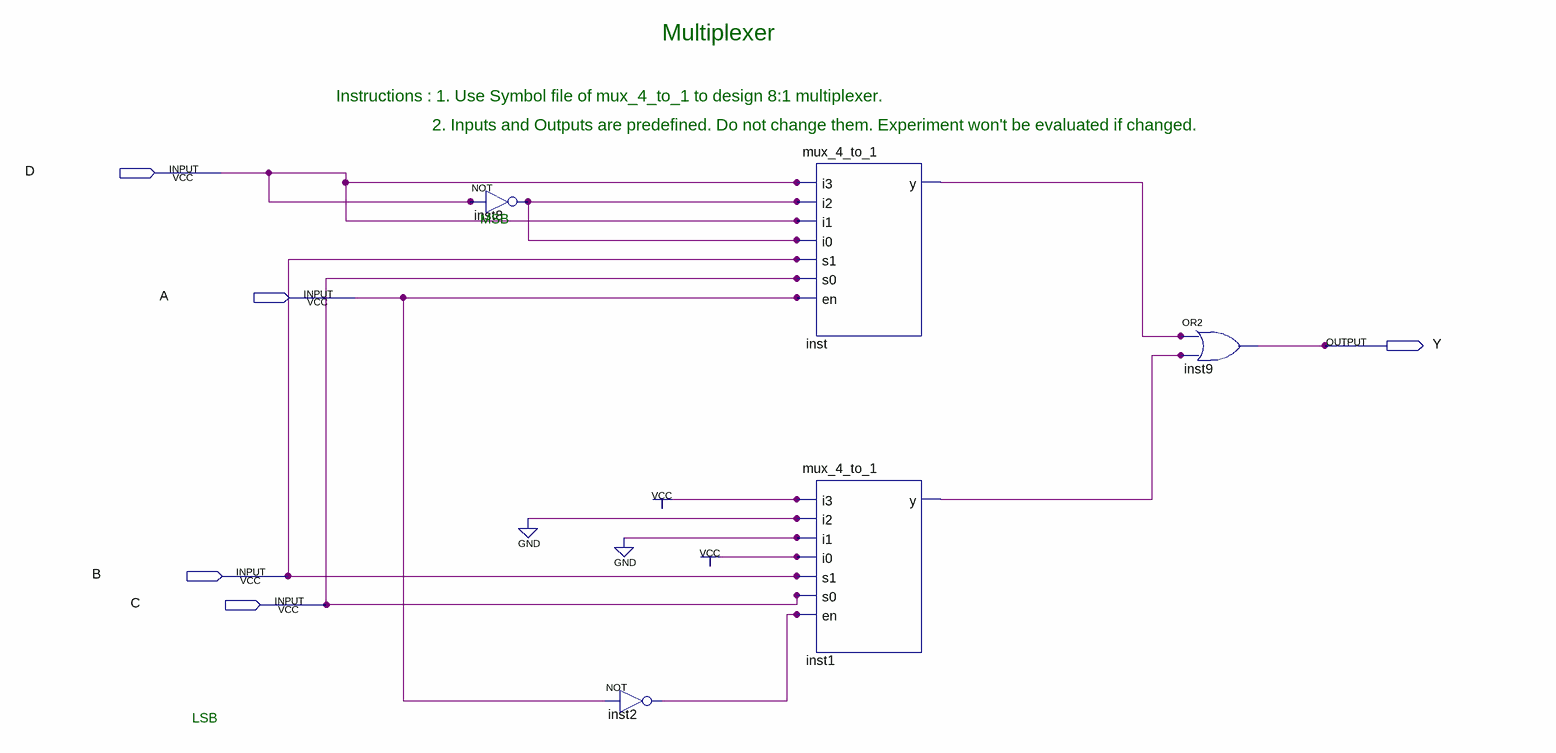
[diagram p0: schematic sheet]
// Quartus schematic mux_8_to_1.bdf as structural Verilog: 5 symbols, 5 pins
module mux_8_to_1 (
  input  D,
  input  A,
  input  B,
  input  C,
  output Y
);

  wire inst1_y, inst2_out, inst8_out, inst_y;

  not inst8 (inst8_out, D);
  not inst2 (inst2_out, A);
  mux_4_to_1 inst (.i3(D), .i2(inst8_out), .i1(D), .i0(inst8_out), .s1(B), .s0(C), .en(A), .y(inst_y));
  mux_4_to_1 inst1 (.i3(1'b1), .i2(1'b0), .i1(1'b0), .i0(1'b1), .s1(B), .s0(C), .en(inst2_out), .y(inst1_y));
  or inst9 (Y, inst_y, inst1_y);

  // Notes on the sheet:
  //   Multiplexer
  //   Instructions : 1. Use Symbol file of mux_4_to_1 to design 8:1 multiplexer. 
  //   2. Inputs and Outputs are predefined. Do not change them. Experiment won't be evaluated if changed.
  //   MSB
  //   LSB
endmodule
